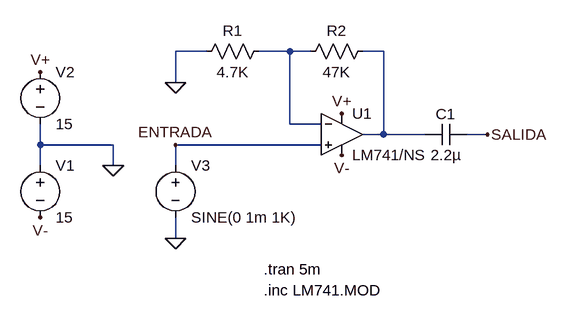
[diagram p0: schematic lm741-no-inversor.asc]
lm741-no-inversor.asc, the LTspice schematic file:
Version 4
SHEET 1 908 680
WIRE 208 48 160 48
WIRE 336 48 288 48
WIRE 368 48 336 48
WIRE 480 48 448 48
WIRE 160 96 160 48
WIRE 336 160 336 48
WIRE 384 160 336 160
WIRE 480 176 480 48
WIRE 480 176 448 176
WIRE 544 176 480 176
WIRE 640 176 608 176
WIRE -48 192 -48 160
WIRE 64 192 -48 192
WIRE 384 192 160 192
WIRE -48 224 -48 192
WIRE 64 224 64 192
WIRE 160 224 160 192
WIRE 160 336 160 304
FLAG 160 96 0
FLAG 64 224 0
FLAG 640 176 SALIDA
FLAG -48 80 V+
FLAG 416 144 V+
FLAG -48 304 V-
FLAG 416 208 V-
FLAG 160 336 0
FLAG 160 192 ENTRADA
SYMBOL Opamps\\opamp2 416 112 R0
SYMATTR InstName U1
SYMATTR Value LM741/NS
SYMBOL voltage -48 208 R0
WINDOW 123 0 0 Left 0
WINDOW 39 0 0 Left 0
SYMATTR InstName V1
SYMATTR Value 15
SYMBOL voltage -48 64 R0
WINDOW 123 0 0 Left 0
WINDOW 39 0 0 Left 0
SYMATTR InstName V2
SYMATTR Value 15
SYMBOL voltage 160 208 R0
WINDOW 123 0 0 Left 0
WINDOW 39 0 0 Left 0
SYMATTR InstName V3
SYMATTR Value SINE(0 1m 1K)
SYMBOL res 464 32 R90
WINDOW 0 0 56 VBottom 2
WINDOW 3 32 56 VTop 2
SYMATTR InstName R2
SYMATTR Value 47K
SYMBOL res 304 32 R90
WINDOW 0 0 56 VBottom 2
WINDOW 3 32 56 VTop 2
SYMATTR InstName R1
SYMATTR Value 4.7K
SYMBOL cap 608 160 R90
WINDOW 0 0 32 VBottom 2
WINDOW 3 32 32 VTop 2
SYMATTR InstName C1
SYMATTR Value 2.2µ
TEXT 296 384 Left 2 !.tran 5m
TEXT 296 416 Left 2 !.inc LM741.MOD

The netlist it stands for:
* lm741-no-inversor.asc
XU1 ENTRADA N001 V+ V- N002 LM741/NS  ; pins In+ In- V+ V- OUT
V1 0 V- 15
V2 V+ 0 15
V3 ENTRADA 0 SINE(0 1m 1K)
R2 N002 N001 47K
R1 N001 0 4.7K
C1 SALIDA N002 2.2µ
.tran 5m
.inc LM741.MOD
.backanno
.end